# EAGLE design Amiga_RPI_Drive_Mini_2.3_SMD (EAGLE 7.6.0)
Amiga RPI Drive Mini by Maurizio Ramondo maurizio@ramondo.net
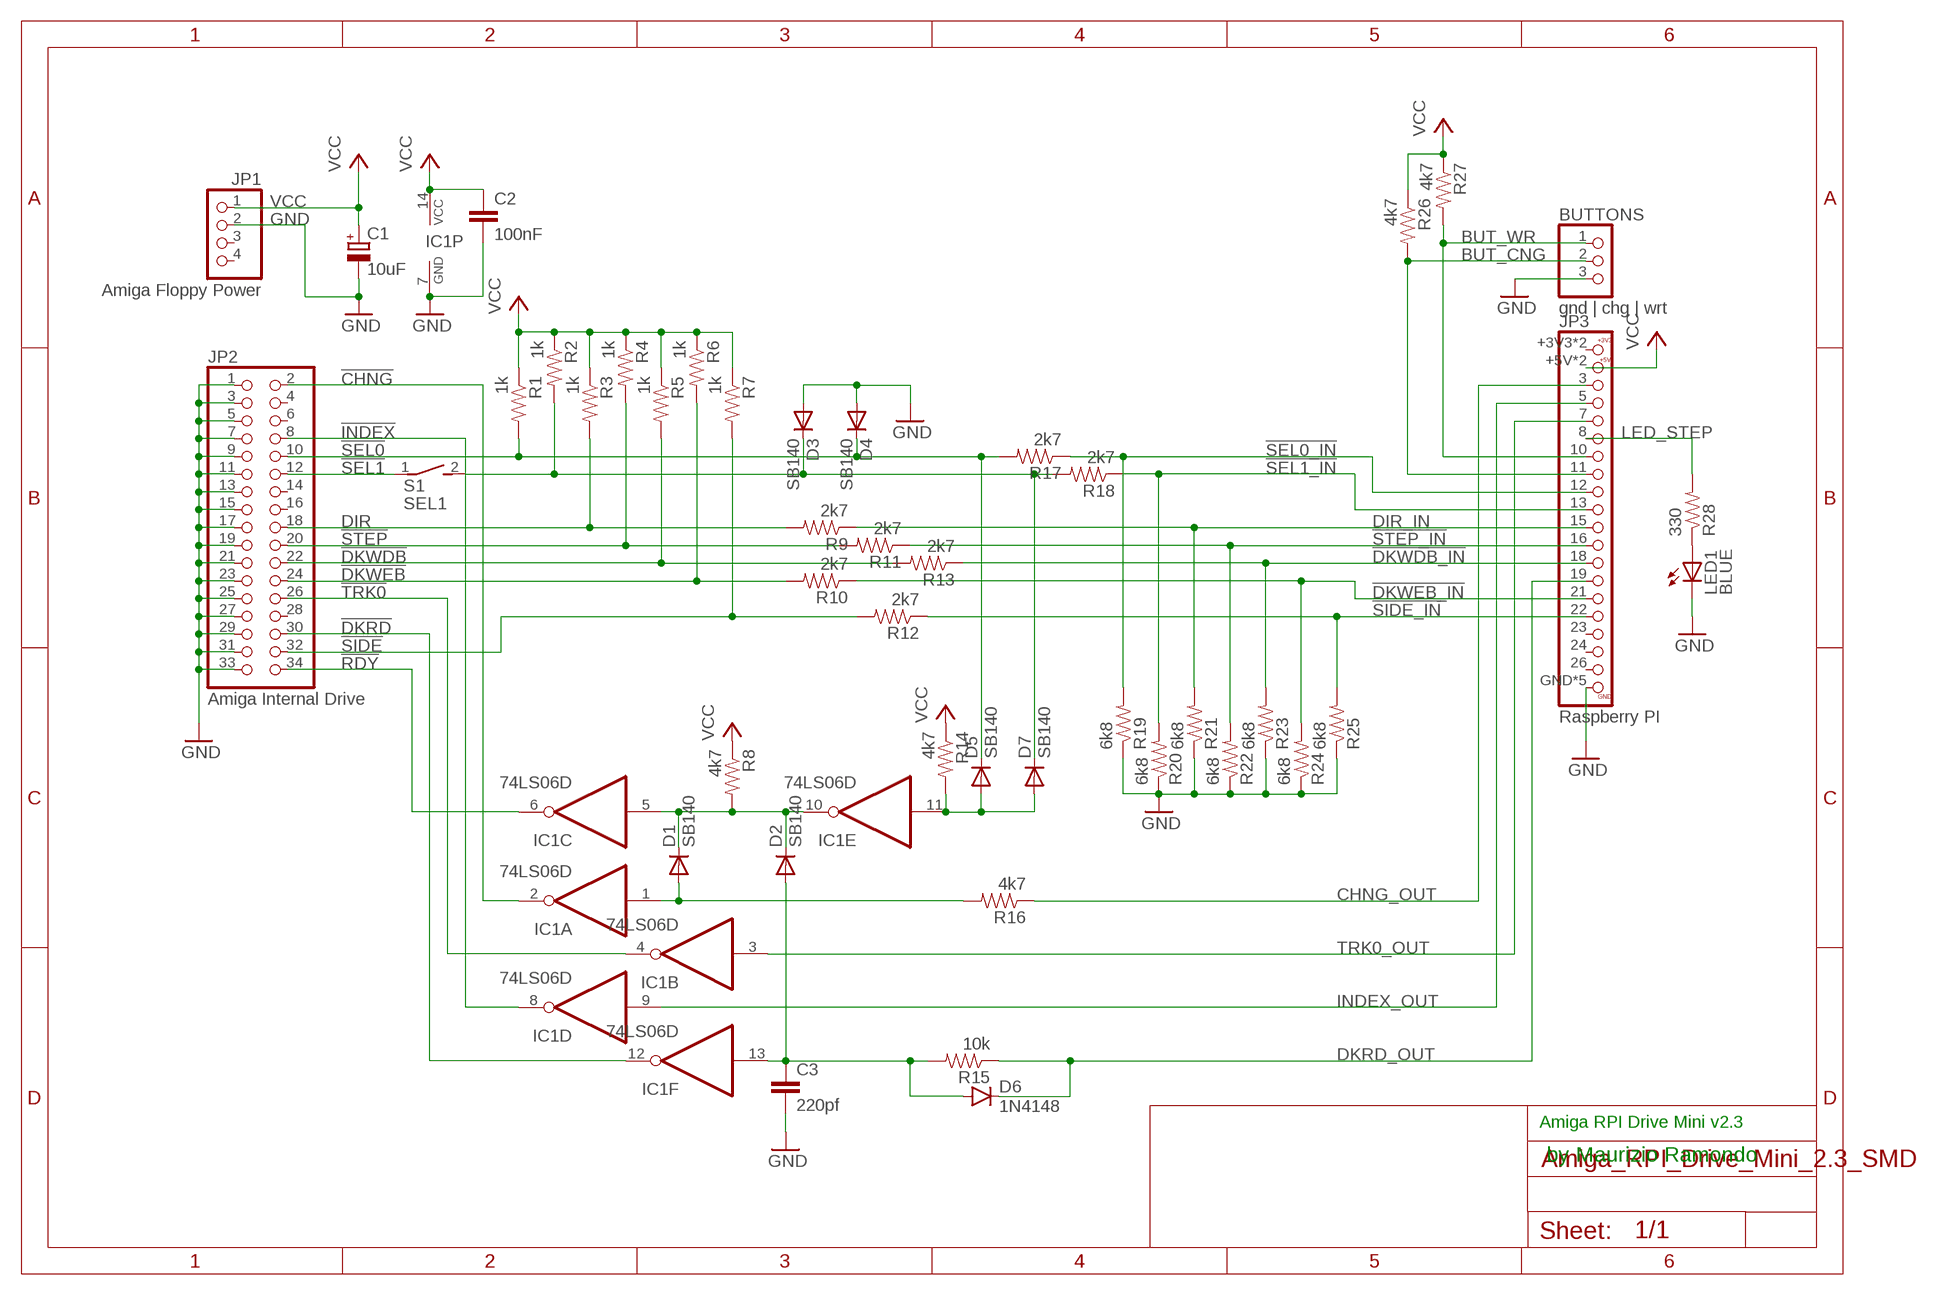
[diagram p0: schematic, sheet 1]

## Parts
BUTTONS  gnd | chg | wrt  PINHD-1X3  [1X03]
C1  10uF  CPOL-EUB  [PANASONIC_B]
C2  100nF  CAP1206  [1206]
C3  220pf  CAP1206  [1206]
D1  SB140  SB120  [DO41-10]
D2  SB140  SB120  [DO41-10]
D3  SB140  SB120  [DO41-10]
D4  SB140  SB120  [DO41-10]
D5  SB140  SB120  [DO41-10]
D6  1N4148  DIODESOD123  [SOD-123]
D7  SB140  SB120  [DO41-10]
IC1  74LS06D  [SO14]
JP1  Amiga Floppy Power  PINHD-1X4/90  [1X04/90]
JP2  Amiga Internal Drive  PINHD-2X17  [2X17]
JP3  Raspberry PI  RPI_P1  [RPI_P1]
LED1  BLUE  LED3MM  [LED3MM]
R1  1k  RESISTOR1206  [1206]
R2  1k  RESISTOR1206  [1206]
R3  1k  RESISTOR1206  [1206]
R4  1k  RESISTOR1206  [1206]
R5  1k  RESISTOR1206  [1206]
R6  1k  RESISTOR1206  [1206]
R7  1k  RESISTOR1206  [1206]
R8  4k7  RESISTOR1206  [1206]
R9  2k7  RESISTOR1206  [1206]
R10  2k7  RESISTOR1206  [1206]
R11  2k7  RESISTOR1206  [1206]
R12  2k7  RESISTOR1206  [1206]
R13  2k7  RESISTOR1206  [1206]
R14  4k7  RESISTOR1206  [1206]
R15  10k  RESISTOR1206  [1206]
R16  4k7  RESISTOR1206  [1206]
R17  2k7  RESISTOR1206  [1206]
R18  2k7  RESISTOR1206  [1206]
R19  6k8  RESISTOR1206  [1206]
R20  6k8  RESISTOR1206  [1206]
R21  6k8  RESISTOR1206  [1206]
R22  6k8  RESISTOR1206  [1206]
R23  6k8  RESISTOR1206  [1206]
R24  6k8  RESISTOR1206  [1206]
R25  6k8  RESISTOR1206  [1206]
R26  4k7  RESISTOR1206  [1206]
R27  4k7  RESISTOR1206  [1206]
R28  330  RESISTOR1206  [1206]
S1  SEL1  DS01E  [DS-01]

## Nets
!CHNG: IC1.2(A:O) JP2.2
!DKRD: IC1.12(F:O) JP2.30
!DKWDB: JP2.22 R5.2 R13.2
!DKWDB_IN: JP3.18 R13.1 R23.2
!DKWEB: JP2.24 R6.2 R10.2
!DKWEB_IN: JP3.21 R10.1 R24.2
!INDEX: IC1.8(D:O) JP2.8
!RDY: IC1.6(C:O) JP2.34
!SEL0: D4.C D5.C JP2.10 R1.2 R17.2
!SEL0_IN: JP3.12 R17.1 R19.2
!SEL1: D3.C D7.C R2.2 R18.2 S1.2
!SEL1_IN: JP3.13 R18.1 R20.2
!SIDE: JP2.32 R7.2 R12.2
!SIDE_IN: JP3.22 R12.1 R25.2
!STEP: JP2.20 R4.2 R11.2
!STEP_IN: JP3.16 R11.1 R22.2
!TRK0: IC1.4(B:O) JP2.26
BUT_CNG: BUTTONS.2 JP3.11 R26.2
BUT_WR: BUTTONS.1 JP3.10 R27.2
CHNG_OUT: JP3.3 R16.1
DIR: JP2.18 R3.2 R9.2
DIR_IN: JP3.15 R9.1 R21.2
DKRD_OUT: D6.C JP3.19 R15.1
GND: BUTTONS.3 C1.- C2.2 C3.2 D3.A D4.A IC1.7(P:GND) JP1.2 JP2.1 JP2.3 JP2.5 JP2.7 JP2.9 JP2.11 JP2.13 JP2.15 JP2.17 JP2.19 JP2.21 JP2.23 JP2.25 JP2.27 JP2.29 JP2.31 JP2.33 JP3.GND JP3.GND@9(GND) JP3.GND@14(GND) JP3.GND@20(GND) JP3.GND@25(GND) LED1.K(C) R19.1 R20.1 R21.1 R22.1 R23.1 R24.1 R25.1
INDEX_OUT: IC1.9(D:I) JP3.5
LED_STEP: JP3.8 R28.2
N$1: D1.A IC1.1(A:I) R16.2
N$5: LED1.A R28.1
N$6: D5.A D7.A IC1.11(E:I) R14.2
N$7: C3.1 D2.A D6.A IC1.13(F:I) R15.2
N$8: D1.C D2.C IC1.5(C:I) IC1.10(E:O) R8.2
N$14: JP2.12 S1.1
TRK0_OUT: IC1.3(B:I) JP3.7
VCC: C1.+ C2.1 IC1.14(P:VCC) JP1.1 JP3.4 JP3.+5V R1.1 R2.1 R3.1 R4.1 R5.1 R6.1 R7.1 R8.1 R14.1 R26.1 R27.1
Unconnected: JP1.3 JP1.4 JP2.4 JP2.6 JP2.14 JP2.16 JP2.28 JP3.23 JP3.24 JP3.26 JP3.+3V3 JP3.+3V3@17

## Notes on the sheet
- Amiga RPI Drive Mini v2.3
- by Maurizio Ramondo

## Library data of the parts
BUTTONS = mau-pinhead:PINHD-1X3: PIN HEADER
C1 = rcl:CPOL-EU: POLARIZED CAPACITOR, European symbol
C2 C3 = SparkFun-Capacitors:CAP: Capacitor Standard 0603 ceramic capacitor, and 0.1" leaded capacitor.
D1-D5 D7 = diode:SB120: DIODE barrier rectifier, 1 A (Fairchild)
D6 = SparkFun-DiscreteSemi:DIODE: Diode These are standard reverse protection diodes and small signal diodes. SMA package can handle up to about 1A. SOD-323 can handle about 200mA. What the SOD-323 package when ordering, there are some mfgs out there that are 5-pin packages.
IC1 = 74xx-eu:74*06: Hex INVERTER, open collector high-voltage output
JP1 = mau-pinhead:PINHD-1X4: PIN HEADER
JP2 = mau-pinhead:PINHD-2X17: PIN HEADER
JP3 = mau-pinhead:RPI_P1: PIN HEADER
LED1 = led:LED: LED OSRAM: - CHIPLED LG R971, LG N971, LY N971, LG Q971, LY Q971, LO R971, LY R971 LH N974, LH R974 LS Q976, LO Q976, LY Q976 LO Q996 - Hyper CHIPLED LW Q18S LB Q993, LB Q99A, LB R99A - SideLED LS A670, LO A670, LY A670, LG A670, LP A670 LB A673, LV A673, LT A673, LW A673 LH A674 LY A675 LS A676, LA A676, LO A676, LY A676, LW A676 LS A679, LY A679, LG A679 - Hyper Micro SIDELED® LS Y876, LA Y876, LO Y876, LY Y876 LT Y87S - SmartLED LW L88C, LW L88S LB L89C, LB L89S, LG L890 LS L89K, LO L89K, LY L89K LS L896, LA L896, LO L896, LY L896 - TOPLED LS T670, LO T670, LY T670, LG T670, LP T670 LSG T670, LSP T670, LSY T670, LOP T670, LYG T670 LG T671, LOG T671, LSG T671 LB T673, LV T673, LT T673, LW T673 LH T674 LS T676, LA T676, LO T676, LY T676, LB T676, LH T676, LSB T676, LW T676 LB T67C, LV T67C, LT T67C, LS T67K, LO T67K, LY T67K, LW E67C LS E67B, LA E67B, LO E67B, LY E67B, LB E67C, LV E67C, LT E67C LW T67C LS T679, LY T679, LG T679 LS T770, LO T770, LY T770, LG T770, LP T770 LB T773, LV T773, LT T773, LW T773 LH T774 LS E675, LA E675, LY E675, LS T675 LS T776, LA T776, LO T776, LY T776, LB T776 LHGB T686 LT T68C, LB T68C - Hyper Mini TOPLED® LB M676 - Mini TOPLED Santana® LG M470 LS M47K, LO M47K, LY M47K Source: http://www.osram.convergy.de LUXEON: - LUMILED® LXK2-PW12-R00, LXK2-PW12-S00, LXK2-PW14-U00, LXK2-PW14-V00 LXK2-PM12-R00, LXK2-PM12-S00, LXK2-PM14-U00 LXK2-PE12-Q00, LXK2-PE12-R00, LXK2-PE12-S00, LXK2-PE14-T00, LXK2-PE14-U00 LXK2-PB12-K00, LXK2-PB12-L00, LXK2-PB12-M00, LXK2-PB14-N00, LXK2-PB14-P00, LXK2-PB14-Q00 LXK2-PR12-L00, LXK2-PR12-M00, LXK2-PR14-Q00, LXK2-PR14-R00 LXK2-PD12-Q00, LXK2-PD12-R00, LXK2-PD12-S00 LXK2-PH12-R00, LXK2-PH12-S00 LXK2-PL12-P00, LXK2-PL12-Q00, LXK2-PL12-R00 Source: www.luxeon.com KINGBRIGHT: KA-3528ASYC Source: www.kingbright.com
R1-R28 = SparkFun-Resistors:RESISTOR: Resistor Basic schematic elements and footprints for 0603, 1206, and PTH resistors.
S1 = switch-dil:DS01E: DIL/CODE SWITCH; OC_FARNELL: unknown; OC_NEWARK: unknown

## Net classes
1 Power: width 0.61 mm, clearance 0.203 mm to class 0, clearance 0.203 mm

## Board
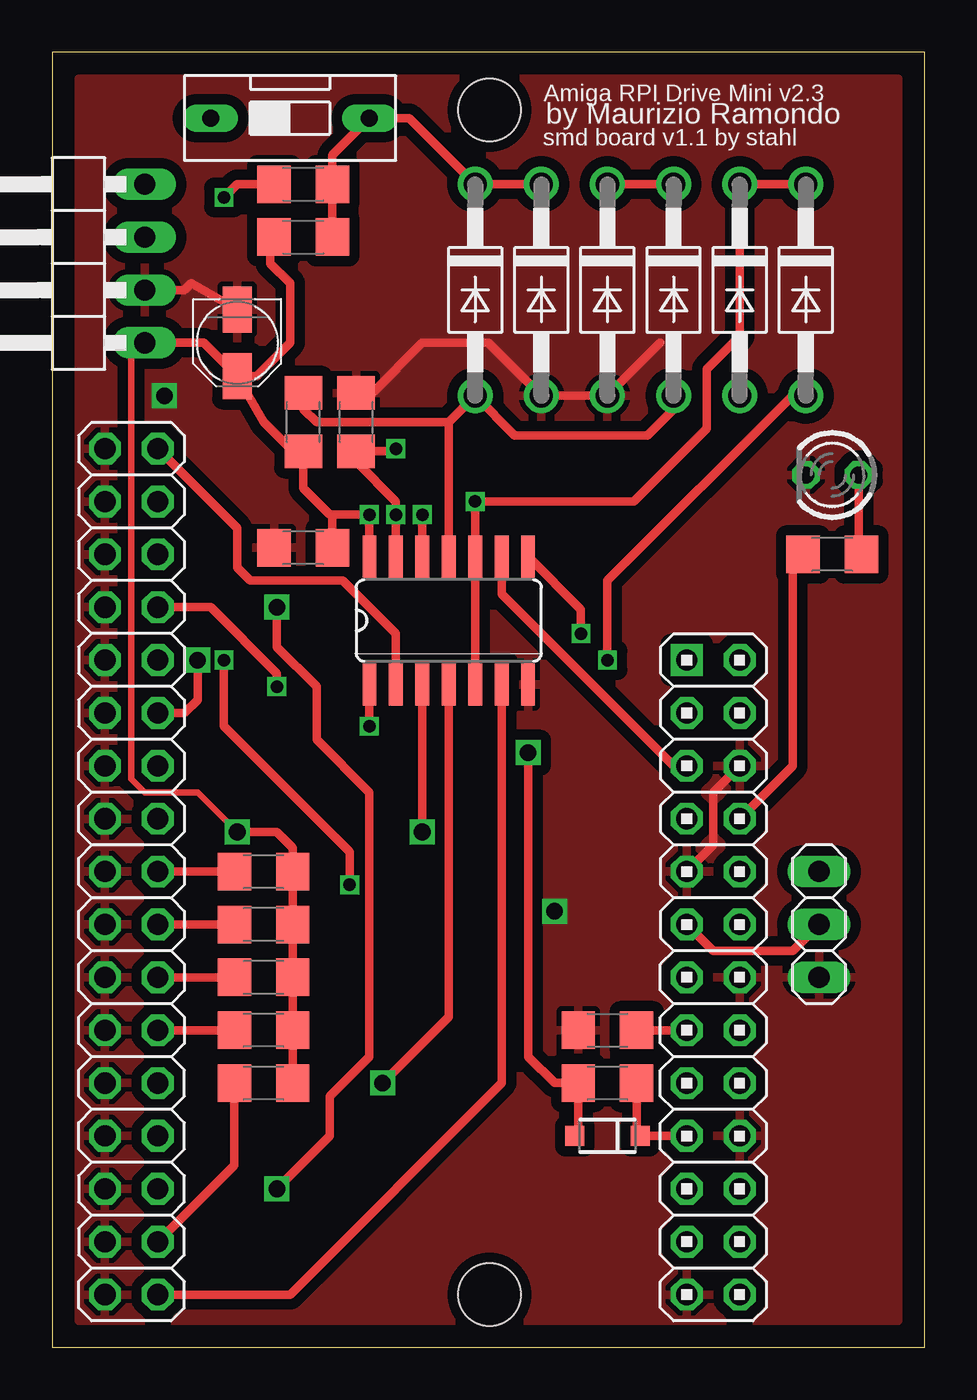
[diagram p1: board, top side]
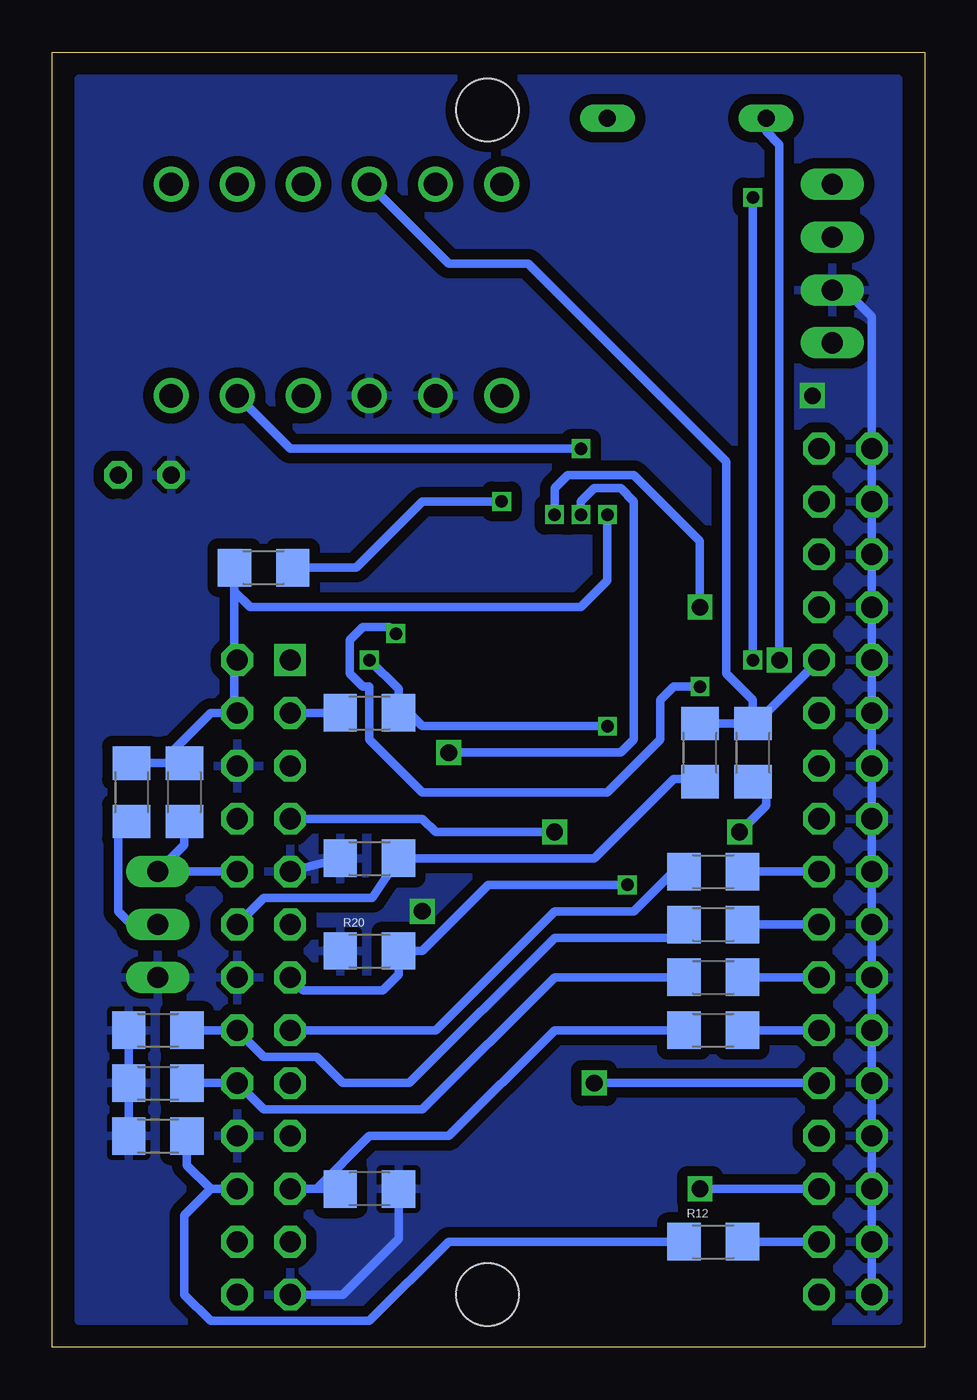
[diagram p2: board, bottom side, seen from below]

Size 41.91 x 62.23 mm. Coordinates in mm from the lower left corner, seen from the top.
Outline: 0,0 41.91,0 41.91,62.23 0,62.22 0,0
Copper layers (1*16): Top 0.035mm / dielectric 1.5mm / Bottom 0.035mm
Design rules "SeeedStudio_2layer_DRU_no_angle_20140221": minimum track width 6mil, minimum drill 12mil, track to track 6mil, track to pad 6mil, pad to pad 6mil, via to via 6mil, smd to smd 0mil, copper to edge 10mil, drill to drill 10mil, minimum pad ring 10mil, minimum via ring 6mil, stop-mask expansion 2mil, vias tented up to drill 100mil, thermal gap 10mil
Holes 3 mm at 21,2.54 21,59.45

### Footprints (pad centres in the part's own frame; a part is rotated, then mirrored left to right if it is on the bottom)
1X03 = drill 1.016 long: 1 -2.54,0; 2 0,0; 3 2.54,0
PANASONIC_B = smd 2.2 x 1.4: + 1.6,0; - -1.6,0
1206 = smd 1.6 x 1.8: 1 -1.4,0; 2 1.4,0
DO41-10 = drill 1.118: A 5.08,0; C -5.08,0
SOD-123 = smd 0.9 x 0.95: A 1.575,0; C -1.575,0
SO14 = smd 0.66 x 2.032: 1 -3.81,-3.073; 2 -2.54,-3.073; 3 -1.27,-3.073; 4 0,-3.073; 5 1.27,-3.073; 6 2.54,-3.073; 7 3.81,-3.073; 8 3.81,3.073; 9 2.54,3.073; 10 1.27,3.073; 11 0,3.073; 12 -1.27,3.073; 13 -2.54,3.073; 14 -3.81,3.073
1X04/90 = drill 1.016 long: 1 -3.81,-3.81; 2 -1.27,-3.81; 3 1.27,-3.81; 4 3.81,-3.81
2X17 = drill 1.016 octagon: 1 -20.32,-1.27; 2 -20.32,1.27; 3 -17.78,-1.27; 4 -17.78,1.27; 5 -15.24,-1.27; 6 -15.24,1.27; 7 -12.7,-1.27; 8 -12.7,1.27; 9 -10.16,-1.27; 10 -10.16,1.27; 11 -7.62,-1.27; 12 -7.62,1.27; 13 -5.08,-1.27; 14 -5.08,1.27; 15 -2.54,-1.27; 16 -2.54,1.27; 17 0,-1.27; 18 0,1.27; 19 2.54,-1.27; 20 2.54,1.27; 21 5.08,-1.27; 22 5.08,1.27; 23 7.62,-1.27; 24 7.62,1.27; 25 10.16,-1.27; 26 10.16,1.27; 27 12.7,-1.27; 28 12.7,1.27; 29 15.24,-1.27; 30 15.24,1.27; 31 17.78,-1.27; 32 17.78,1.27; 33 20.32,-1.27; 34 20.32,1.27
RPI_P1 = drill 1.016 octagon: 3 -12.7,-1.27; 4 -12.7,1.27; 5 -10.16,-1.27; 7 -7.62,-1.27; 8 -7.62,1.27; 10 -5.08,1.27; 11 -2.54,-1.27; 12 -2.54,1.27; 13 0,-1.27; 15 2.54,-1.27; 16 2.54,1.27; 18 5.08,1.27; 19 7.62,-1.27; 21 10.16,-1.27; 22 10.16,1.27; 23 12.7,-1.27; 24 12.7,1.27; 26 15.24,1.27; +3V3@17 5.08,-1.27; +5V -15.24,1.27; GND -10.16,1.27; GND@9 -5.08,-1.27; GND@14 0,1.27; GND@20 7.62,1.27; GND@25 15.24,-1.27 | drill 1.016 square: +3V3 -15.24,-1.27
LED3MM = drill 0.813 octagon: A -1.27,0; K 1.27,0
DS-01 = drill 0.813 long: 1 0,-3.81; 2 0,3.81

### Placement (x,y rotation side)
BUTTONS  36.83,20.32 270 top
C1  8.89,48.26 270 top
C2  12.06,38.42 180 top
C3  14.61,44.45 90 top
D1  36.2,50.8 270 top
D2  33.02,50.8 270 top
D3  23.5,50.8 270 top
D4  26.67,50.8 270 top
D5  29.84,50.8 270 top
D6  26.67,10.16 180 top
D7  20.32,50.8 270 top
IC1  19.05,34.92 0 top
JP1  0.64,52.07 90 top
JP2  3.81,22.86 270 top
JP3  31.75,17.78 270 top
LED1  37.47,41.91 180 top
R1  8.26,28.57 90 bottom
R2  12.06,53.34 0 top
R3  10.16,22.86 180 top
R4  10.16,20.32 180 top
R5  10.16,17.78 180 top
R6  10.16,15.24 180 top
R7  10.16,12.7 180 top
R8  31.75,37.47 0 bottom
R9  10.16,22.86 0 bottom
R10  10.16,15.24 0 bottom
R11  10.16,20.32 0 bottom
R12  10.16,5.08 0 bottom
R13  10.16,17.78 0 bottom
R14  12.06,44.45 90 top
R15  26.67,12.7 180 top
R16  26.67,30.48 0 bottom
R17  10.79,28.57 90 bottom
R18  12.06,55.88 0 top
R19  26.67,23.5 0 bottom
R20  26.67,19.05 0 bottom
R21  26.67,15.24 0 top
R22  36.83,15.24 0 bottom
R23  36.83,12.7 0 bottom
R24  26.67,7.62 180 bottom
R25  36.83,10.16 0 bottom
R26  38.1,26.67 270 bottom
R27  35.56,26.67 270 bottom
R28  37.47,38.1 180 top
S1  11.43,59.06 270 top

### Tracks (layer width: path | path; a pad name or v marks a point on that pad's centre or on a via)
!CHNG
  Top 0.406: JP2.2 8.89,39.37 8.89,37.47 9.53,36.83 13.97,36.83 16.51,34.29 IC1.2
!DKRD  (via drill 0.6, 0.8)
  Top 0.406: IC1.12 v17.78,40 | v10.79,7.62 13.34,10.16 13.34,12.06 15.24,13.97 15.24,26.67 12.7,29.21 12.7,31.75 10.79,33.66 v10.79,35.56
  Bottom 0.406: v10.79,7.62 JP2.30 | v17.78,40 17.78,41.28 17.14,41.91 13.97,41.91 10.79,38.73 v10.79,35.56
!DKWDB
  Top 0.406: R13.2 JP2.22
  Bottom 0.406: JP2.22 R13.2
!DKWDB_IN
  Bottom 0.406: R23.2 JP3.18 31.75,11.43 24.13,11.43 17.78,17.78 R13.1
!DKWEB
  Top 0.406: R10.2 JP2.24
  Bottom 0.406: JP2.24 R10.2
!DKWEB_IN
  Bottom 0.406: JP3.21 29.21,7.62 | 29.21,7.62 R24.2 | R10.1 17.78,15.24 22.86,10.16 26.67,10.16 29.21,7.62
!INDEX  (via drill 0.6)
  Top 0.406: JP2.8 7.62,35.56 10.79,32.39 v10.79,31.75 | v25.4,34.29 25.4,35.46 IC1.8
  Bottom 0.406: v10.79,31.75 12.06,31.75 12.7,31.11 12.7,29.21 15.24,26.67 24.13,26.67 26.67,29.21 26.67,31.75 26.99,31.75 27.62,32.39 27.62,33.97 26.99,34.61 25.72,34.61 v25.4,34.29
!RDY
  Top 0.406: IC1.6 21.59,12.7 11.43,2.54 JP2.34
!SEL0
  Top 0.406: D4.C D5.C
  Bottom 0.406: 8.26,30.48 8.26,31.11 9.53,32.39 9.53,42.55 19.05,52.07 22.86,52.07 D4.C | 8.26,30.48 R1.2 R17.2 | JP2.10 7.62,30.48 8.26,30.48
!SEL0_IN
  Bottom 0.406: JP3.12 31.75,21.59 26.54,21.59 R19.2 25.4,22.86 24.77,23.5 15.88,23.5 12.06,27.3 10.93,27.3 R17.1
!SEL1
  Top 0.406: D3.C D7.C 17.14,59.06 S1.2 13.46,57.28 R18.2 R2.2
!SEL1_IN  (via drill 0.6)
  Top 0.406: R18.1 8.89,55.88 v8.26,55.25 | v8.26,33.02 8.26,29.85 14.29,23.81 v14.29,22.22
  Bottom 0.305: R20.2 25.27,18.54
  Bottom 0.406: 25.27,18.54 25.27,17.91 26.04,17.14 29.84,17.14 JP3.13 | v8.26,55.25 v8.26,33.02 | v14.29,22.22 20.95,22.22 24.13,19.05 R20.2
!SIDE
  Top 0.406: R7.2 8.76,8.76 JP2.32
  Bottom 0.406: R12.2 JP2.32
!SIDE_IN
  Bottom 0.406: R12.1 22.86,5.08 26.67,1.27 34.29,1.27 35.56,2.54 35.56,6.35 34.29,7.62 | 34.29,7.62 JP3.22 | R25.2 35.43,8.76 34.29,7.62
!STEP
  Top 0.406: R11.2 JP2.20
  Bottom 0.406: R11.2 JP2.20
!STEP_IN
  Bottom 0.406: R22.2 JP3.16 31.75,13.97 29.21,13.97 27.94,12.7 24.77,12.7 17.78,19.68 12.06,19.68 11.56,20.19 R11.1
!TRK0  (via drill 0.8)
  Top 0.406: IC1.4 19.05,15.87 v15.88,12.7
  Bottom 0.406: v15.88,12.7 JP2.26
BUT_CNG
  Top 0.406: JP3.11 31.75,19.05 35.56,19.05 BUTTONS.2
  Bottom 0.406: BUTTONS.2 38.1,20.32 38.73,20.96 38.73,24.64 R26.2
BUT_WR
  Bottom 0.406: JP3.10 BUTTONS.1 35.56,24.13 R27.2
CHNG_OUT
  Bottom 0.406: R16.1 JP3.3
DIR
  Top 0.406: R9.2 JP2.18
  Bottom 0.406: JP2.18 R9.2
DIR_IN
  Top 0.406: R21.2 JP3.15
  Bottom 0.406: R9.1 12.06,22.86 13.97,20.96 17.78,20.96 23.5,15.24 JP3.15
DKRD_OUT
  Top 0.406: R15.1 28.07,10.34 D6.C JP3.19
GND  (via drill 0.8)
  Top 0.406: JP3.GND@9 31.75,24.13 31.75,26.67 JP3.GND | R21.1 25.27,15.11 | 14.3,46.16 C3.2 15.37,45.85 17.78,48.26 20.95,48.26 D3.A D4.A 29.21,48.26 | C1.- 6.68,51.13 6.35,50.8 JP1.2
  Bottom 0.406: R22.1 R23.1 R25.1 | R24.1 25.27,5.21 27.94,2.54 JP3.GND@25 | R19.1 JP3.GND@9 | JP1.2 3.81,50.8 2.54,49.53 JP2.1 JP2.7 JP2.33 | R20.1 28.07,19.55
  other vias: 24.13,20.96 5.4,45.72
  pour Top (isolate 0.5): 1.27,60.96 40.64,60.96 40.64,1.27 1.27,1.27
  pour Bottom (isolate 0.5): 1.27,60.96 40.64,60.96 40.64,1.27 1.27,1.27
INDEX_OUT
  Top 0.406: 21.59,38.1 IC1.9 21.59,36.19 29.84,27.94 JP3.5
LED_STEP
  Top 0.406: R28.2 36.06,37.59 35.56,38.1 35.56,27.94 JP3.8
N$1  (via drill 0.6)
  Top 0.406: v15.24,29.85 IC1.1 | D1.A 35.56,45.72 26.67,36.83 v26.67,33.02
  Bottom 0.406: v15.24,29.85 24.13,29.85 24.77,30.48 R16.2 25.27,31.62 v26.67,33.02
N$5
  Top 0.406: 38.97,38.2 R28.1 38.73,38.23 LED1.A
N$6
  Top 0.406: 19.05,44.45 12.7,44.45 12.06,45.09 R14.2 | D5.A 29.84,45.09 28.57,43.81 22.23,43.81 D7.A 19.68,45.09 19.05,44.45 | IC1.11 19.05,44.45
N$7  (via drill 0.6, 0.8)
  Top 0.406: D6.A 25.27,10.34 R15.2 24.13,12.7 22.86,13.97 v22.86,28.57 | 14.73,43.18 C3.1 | IC1.13 v16.51,40 16.51,40.64 14.61,42.55 C3.1 | C3.1 16.38,43.05 v16.51,43.18
  Bottom 0.406: v22.86,28.57 14.61,28.57 13.97,29.21 13.97,40.64 14.61,41.28 15.88,41.28 16.51,40.64 v16.51,40 | v16.51,43.18 30.48,43.18 D2.A
N$8  (via drill 0.6)
  Top 0.406: IC1.5 IC1.10 v20.32,40.64 27.94,40.64 31.43,44.13 31.43,46.99 33.02,48.58 D2.C D1.C
  Bottom 0.406: R8.2 27.3,37.47 24.13,40.64 v20.32,40.64
N$14  (via drill 0.8)
  Top 0.406: v6.99,33.02 6.99,31.11 6.35,30.48 JP2.12
  Bottom 0.406: S1.1 7.62,58.42 6.99,57.78 v6.99,33.02
TRK0_OUT  (via drill 0.8)
  Top 0.406: IC1.3 v17.78,24.76
  Bottom 0.406: v17.78,24.76 23.5,24.76 24.13,25.4 JP3.7
VCC  (via drill 0.6, 0.8)
  Top 0.305: JP1.1 3.81,48.26 3.81,27.3 4.45,26.67 6.99,26.67 v8.89,24.76
  Top 0.406: R7.1 R6.1 R5.1 R4.1 R3.1 11.56,24 10.79,24.76 v8.89,24.76 | 13.34,40 v15.24,40 IC1.14 | 13.34,40 12.06,41.28 R14.1 11.56,43.05 10.16,44.45 C1.+ | 10.16,53.47 R2.1 10.48,53.15 10.48,52.07 11.43,51.12 11.43,48.26 9.83,46.66 C1.+ | C2.1 13.46,39.88 13.34,40 | JP1.1 7.29,48.26 C1.+
  Bottom 0.406: R26.1 R27.1 36.2,28.57 34.29,30.48 JP3.4 33.15,30.61 33.15,33.15 | 33.15,36.33 33.15,33.15 | 33.15,33.15 JP3.+5V | R8.1 33.15,36.33 | 33.15,36.33 32.38,35.56 16.51,35.56 15.24,36.83 v15.24,40 | R1.1 7.62,26.67 7.62,26.04 v8.89,24.76

### Text on the board
tNames: Amiga RPI Drive Mini v2.3 | by Maurizio Ramondo | smd board v1.1 by stahl